# Altium project VisitCard.PrjPcb
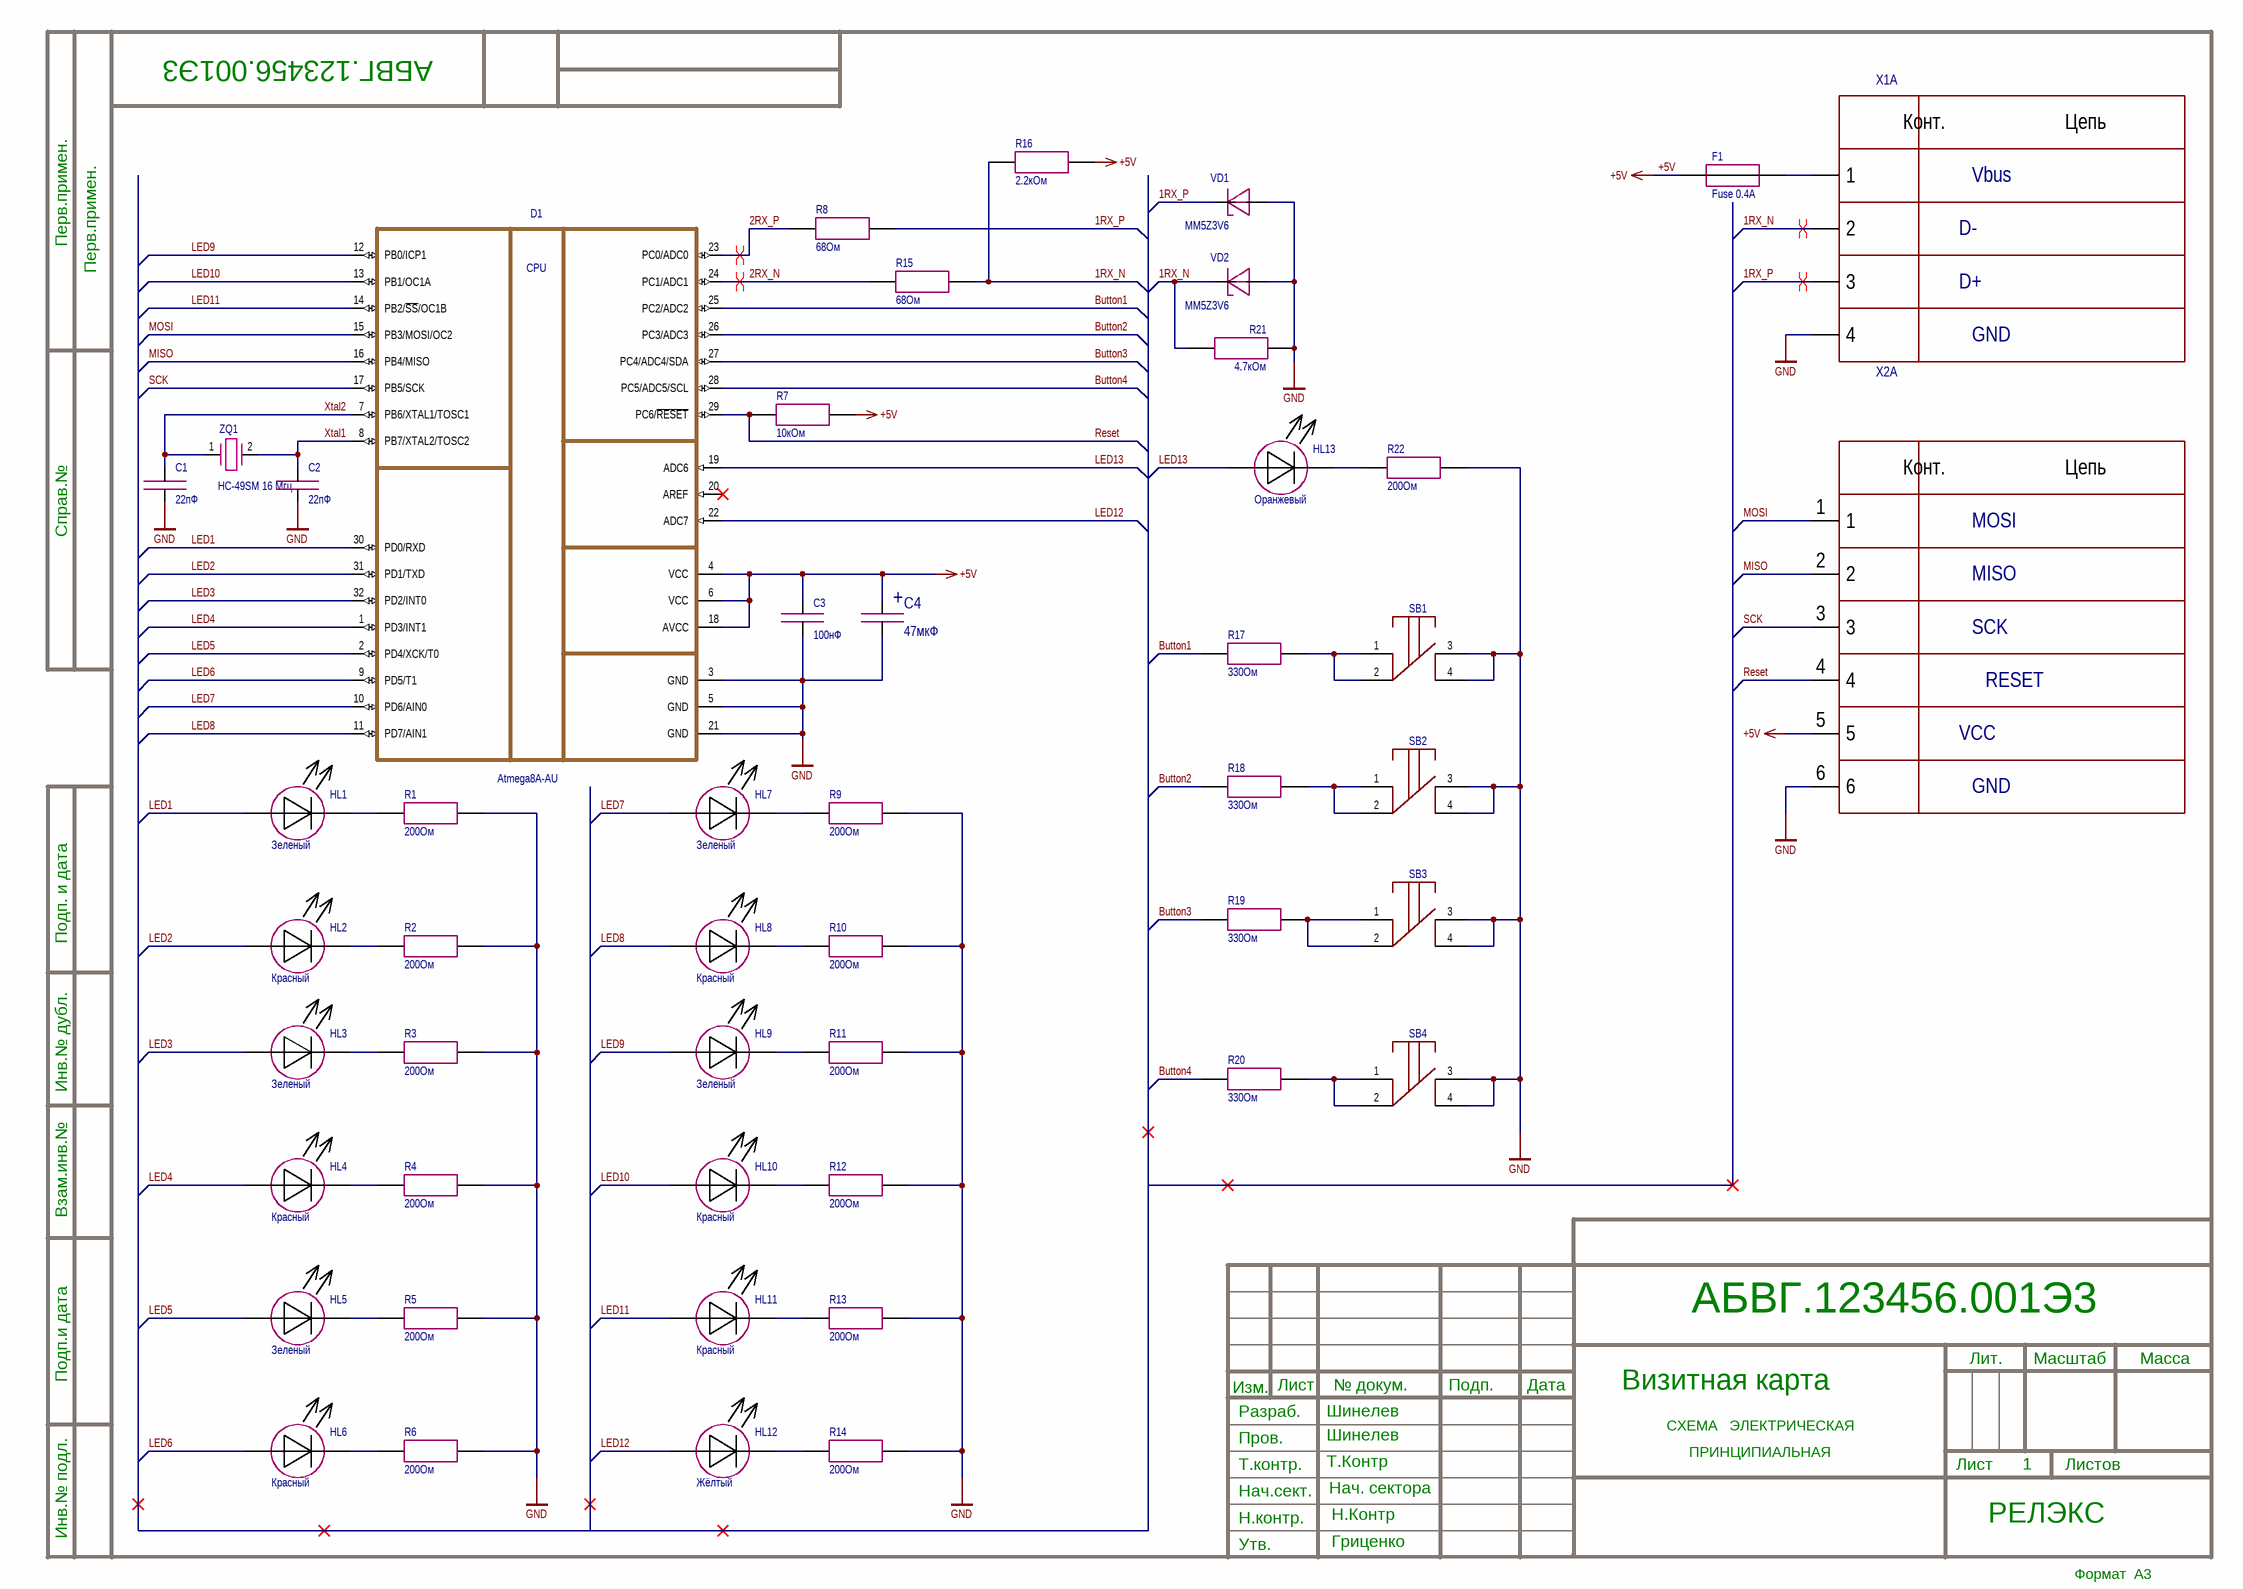
[diagram p0: VisitCardScheme.SchDoc]
1 sheet, 50 parts. Net scope: global (net labels, ports and power ports of the same name join across sheets).
Board file: VisitCardPCB.PcbDoc

## Sheet VisitCardScheme.SchDoc: Наименование
size 420 x 297 mm; Date: 15.06.2018; ApprovedBy: Гриценко; CheckedBy: Шинелев; Author: Шинелев; CompanyName: РЕЛЭКС; DrawnBy: Н.Контр; Engineer: Т.Контр; SheetNumber: 1; SheetTotal: 1; PageSetup: Record=PageOptions|CenterHorizontal=True|CenterVertical=True|PrintScale=0.94|XCorrection=1.00|YCorrection=1.00|PrintKind=1|BorderSize=5000000|LeftOffset=0|BottomOffset=0|Orientation=1|PaperLength=1000|PaperWidth=1000|Scale=100|PaperSource=7|PrintQuality=-4|MediaType=1|DitherType=10|PaperKind=A4|PrintScaleMode=1; DecimalNumber: АБВГ.123456.001Э3; HeadOfSector: Нач. сектора; MainDevice: Перв.примен.; Name: Визитная карта; CurrentDate: 15.06.2018; DocumentName: Sheet1.SCHDOC

### Parts
C1  value 22пФ  [C0603]  (hidden comment: Конденсатор22пФ)
C2  value 22пФ  [C0603]  (hidden comment: Конденсатор22пФ)
C3  value 100нФ  [C0603]  (hidden comment: Конденсатор100нФ)
C4  value 47мкФ  [CaseB]  (hidden comment: Конденсатор 47мкФ)
D1  value Atmega8A-AU  [A32]  (hidden comment: МикросхемаAtmega8A-AU)
F1  Fuse 0.4A  [Fuse 0.4A]
HL1  Примечание: Зеленый  [LED0402_Green]  (hidden comment: СветодиодKPHHS-1005MGCK)
HL2  Примечание: Красный  [LED0402_Red]  (hidden comment: СветодиодKPHHS-1005SURCK)
HL3  Примечание: Зеленый  [LED0402_Green]  (hidden comment: СветодиодKPHHS-1005MGCK)
HL4  Примечание: Красный  [LED0402_Red]  (hidden comment: СветодиодKPHHS-1005SURCK)
HL5  Примечание: Зеленый  [LED0402_Green]  (hidden comment: СветодиодKPHHS-1005MGCK)
HL6  Примечание: Красный  [LED0402_Red]  (hidden comment: СветодиодKPHHS-1005SURCK)
HL7  Примечание: Зеленый  [LED0402_Green]  (hidden comment: СветодиодKPHHS-1005MGCK)
HL8  Примечание: Красный  [LED0402_Red]  (hidden comment: СветодиодKPHHS-1005SURCK)
HL9  Примечание: Зеленый  [LED0402_Green]  (hidden comment: СветодиодKPHHS-1005MGCK)
HL10  Примечание: Красный  [LED0402_Red]  (hidden comment: СветодиодKPHHS-1005SURCK)
HL11  Примечание: Красный  [LED0402_Red]  (hidden comment: СветодиодKPHHS-1005SURCK)
HL12  Примечание: Жёлтый  [LED0402_Yellow]  (hidden comment: СветодиодKPHHS-1005SYCK)
HL13  Примечание: Оранжевый  [LED0402_Orange]  (hidden comment: СветодиодKPHHS-1005SECK)
R1  200Ом  [R0603]
R2  200Ом  [R0603]
R3  200Ом  [R0603]
R4  200Ом  [R0603]
R5  200Ом  [R0603]
R6  200Ом  [R0603]
R7  10кОм  [R0603]
R8  68Ом  [R0603]
R9  200Ом  [R0603]
R10  200Ом  [R0603]
R11  200Ом  [R0603]
R12  200Ом  [R0603]
R13  200Ом  [R0603]
R14  200Ом  [R0603]
R15  68Ом  [R0603]
R16  2.2кОм  [R0603]
R17  330Ом  [R0603]
R18  330Ом  [R0603]
R19  330Ом  [R0603]
R20  330Ом  [R0603]
R21  4.7кОм  [R0603]
R22  200Ом  [R0603]
SB1  Family+Value  [1-1437565-6]  (value not drawn)
SB2  Family+Value  [1-1437565-6]  (value not drawn)
SB3  Family+Value  [1-1437565-6]  (value not drawn)
SB4  Family+Value  [1-1437565-6]  (value not drawn)
VD1  value MM5Z3V6  [SOD-523F]  (hidden comment: СтабилитронMM5Z3V6)
VD2  value MM5Z3V6  [SOD-523F]  (hidden comment: СтабилитронMM5Z3V6)
X1  Вилка USB  [USB]  (value not drawn)  (parts A,B,C,D,E of 5)
X2  (no value)  [SPI]  (parts A,B,C,D,E,F,G of 7)
ZQ1  value HC-49SM 16 Мгц  [HC-49SM]  (hidden comment: РезонаторHC-49SM 16 Мгц)

### Nets
+5V: C3.2 C4.1 D1.4(VCC) D1.6(VCC) D1.18(AVCC) F1.1 R7.2 R16.2 X2.5
GND: C1.1 C2.1 C3.1 C4.2 D1.3(GND) D1.5(GND) D1.21(GND) R1.2 R2.2 R3.2 R4.2 R5.2 R6.2 R9.2 R10.2 R11.2 R12.2 R13.2 R14.2 R21.1 R22.2 SB1.3 SB1.4 SB1.5 SB2.3 SB2.4 SB2.5 SB3.3 SB3.4 SB3.5 SB4.3 SB4.4 SB4.5 VD1.2(A) VD2.2(A) X1.4 X2.6
1RX_N: R15.2 R16.1 R21.2 VD2.1(C) X1.2
1RX_P: R8.2 VD1.1(C) X1.3
2RX_N: D1.24(PC1/ADC1) R15.1
2RX_P: D1.23(PC0/ADC0) R8.1
Button1: D1.25(PC2/ADC2) R17.1
Button2: D1.26(PC3/ADC3) R18.1
Button3: D1.27(PC4/ADC4/SDA) R19.1
Button4: D1.28(PC5/ADC5/SCL) R20.1
LED1: D1.30(PD0/RXD) HL1.1(+)
LED2: D1.31(PD1/TXD) HL2.1(+)
LED3: D1.32(PD2/INT0) HL3.1(+)
LED4: D1.1(PD3/INT1) HL4.1(+)
LED5: D1.2(PD4/XCK/T0) HL5.1(+)
LED6: D1.9(PD5/T1) HL6.1(+)
LED7: D1.10(PD6/AIN0) HL7.1(+)
LED8: D1.11(PD7/AIN1) HL8.1(+)
LED9: D1.12(PB0/ICP1) HL9.1(+)
LED10: D1.13(PB1/OC1A) HL10.1(+)
LED11: D1.14(PB2/~{SS}/OC1B) HL11.1(+)
LED12: D1.22(ADC7) HL12.1(+)
LED13: D1.19(ADC6) HL13.1(+)
MISO: D1.16(PB4/MISO) X2.2
MOSI: D1.15(PB3/MOSI/OC2) X2.1
Reset: D1.29(PC6/~{RESET}) R7.1 X2.4
SCK: D1.17(PB5/SCK) X2.3
Xtal1: C2.2 D1.8(PB7/XTAL2/TOSC2) ZQ1.2
Xtal2: C1.2 D1.7(PB6/XTAL1/TOSC1) ZQ1.1
NetF1_2: F1.2 X1.1
NetHL1_2: HL1.2(-) R1.1
NetHL2_2: HL2.2(-) R2.1
NetHL3_2: HL3.2(-) R3.1
NetHL4_2: HL4.2(-) R4.1
NetHL5_2: HL5.2(-) R5.1
NetHL6_2: HL6.2(-) R6.1
NetHL7_2: HL7.2(-) R9.1
NetHL8_2: HL8.2(-) R10.1
NetHL9_2: HL9.2(-) R11.1
NetHL10_2: HL10.2(-) R12.1
NetHL11_2: HL11.2(-) R13.1
NetHL12_2: HL12.2(-) R14.1
NetHL13_2: HL13.2(-) R22.1
NetR17_2: R17.2 SB1.1 SB1.2
NetR18_2: R18.2 SB2.1 SB2.2
NetR19_2: R19.2 SB3.1 SB3.2
NetR20_2: R20.2 SB4.1 SB4.2

Not connected (* = marked no-connect by the designer): D1 20(AREF)*

### Layout directives
differential pair: 1RX_N, 1RX_P, 2RX_N, 2RX_P

### Notes on the sheet
- Перв.примен.
- Справ.№
- Подп. и дата
- Инв.№ дубл.
- Взам.инв.№
- Подп.и дата
- Разраб.
- Изм.
- Лист
- № докум.
- Подп.
- Дата
- Лит.
- Масштаб
- Масса
- Т.контр.
- Пров.
- СХЕМА   ЭЛЕКТРИЧЕСКАЯ
- ПРИНЦИПИАЛЬНАЯ
- Листов
- Инв.№ подл.
- Утв.
- Н.контр.
- Нач.сект.
- Формат  A3
- (in symbol Atmega8A-AU) CPU
- (in symbol SPI_pcb, part A) Конт.; Цепь
- (in symbol SPI_pcb, part B) MOSI
- (in symbol SPI_pcb, part C) MISO
- (in symbol SPI_pcb, part D) SCK
- (in symbol SPI_pcb, part E) RESET
- (in symbol SPI_pcb, part F) VCC
- (in symbol SPI_pcb, part G) GND
- (in symbol TECAP47/10VB10) +
- (in symbol USB_pcb, part A) Конт.; Цепь
- (in symbol USB_pcb, part B) Vbus
- (in symbol USB_pcb, part C) D-
- (in symbol USB_pcb, part D) D+
- (in symbol USB_pcb, part E) GND

### Library data of the parts
C1 C2 = GRM1885C1H220JA01D: Конденсатор керамический; Manufacturer: Murata; Tolerance: ±5%; Voltage: 50В; ManufacturerPartNumber: GRM1885C1H220JA01D; Part Number: *; Power/Voltage: *; Rem: *; TKE: *; Корпус: C0603; Примечание: *; ComponentLink1Description: Datasheet; ComponentLink1URL: E:\YandexDisk\!Projects\Datasheet\Забугор\Murata\Capacitors ceramic.pdf; ComponentLink2Description: *; ComponentLink2URL: *; Temperature: -55...+125; Family: Конденсатор; Supplier 1: Digi-Key; Supplier Part Number 1: 490-1411-1-ND
C3 = GRM1885C1HR10BD01D: Конденсатор керамический; Manufacturer: Murata; Tolerance: ±5%; Voltage: 50В; ManufacturerPartNumber: GRM1885C1HR10BD01D; Part Number: *; Power/Voltage: *; Rem: *; TKE: *; Корпус: C0603; Примечание: *; ComponentLink1Description: Datasheet; ComponentLink1URL: E:\YandexDisk\!Projects\Datasheet\Забугор\Murata\Capacitors ceramic.pdf; ComponentLink2Description: *; ComponentLink2URL: *; Temperature: -55...+125; Family: Конденсатор; Supplier 1: Mouser; Supplier Part Number 1: 81-GRM1885C1HR10BD1D
C4 = TECAP47/10VB10: Конденсатор танталовый; Manufacturer: TECAP; Temp: -55...+85; TU/GOST: АЖЯР.673546.004ТУ; Tolerance: 10%; Umax: 6.3В; Корпус: CASEB; Family: Конденсатор; ComponentLink1URL: E:\YandexDisk\!Projects\Datasheet\Забугор\Конденсаторы\Танталовые smd.pdf; ComponentLink1Description: Документация; Description2: *; ComponentLink2Description: *; ComponentLink2URL: *; ManufacturerPartNumber: TECAP47/10VB10; Power/Voltage: *; Rem: *; TKE: *; Примечание: *
D1 = Atmega8A-AU: Микроконтроллер, 8 бит, 16 МГц, 8 кБайт FLASH, 1 кБайт SRAM; Manufacturer: Microchip\Atmel; Корпус: 32A; Voltage: 5В; ManufacturerPartNumber: Atmega8A-AU; Part Number: *; Power/Voltage: *; Rem: *; TKE: *; Tolerance: *; Примечание: *; ComponentLink1Description: Datasheet; ComponentLink1URL: E:\YandexDisk\!Projects\Datasheet\Забугор\Atmel\Atmega8a.pdf; ComponentLink2Description: Site; ComponentLink2URL: https://www.microchip.com/wwwproducts/en/ATmega8A; Temperature: -40...+85; Family: Микросхема
F1 = 160016.0,4: Предохранитель 400 мА; Manufacturer: Siba; Power/Voltage: 250В; Current: 400мА; Value: Fuse 0.4A; ManufacturerPartNumber: 160016.0,4; Part Number: *; Rem: *; TKE: *; Tolerance: *; Корпус: *; Примечание: *; ComponentLink1Description: Datasheet; ComponentLink1URL: E:\YandexDisk\!Projects\Datasheet\Забугор\Siba\Fuse.pdf; ComponentLink2Description: *; ComponentLink2URL: *; Family: Предохранитель; Supplier 1: Farnell; Supplier Part Number 1: 2132113
HL1 HL3 HL5 HL7 HL9 = KPHHS-1005MGCK: Светодиод, зеленый, SMD; Manufacturer: Kingbright; Корпус: LED0402; Current: 20мА; Voltage: 2.1В; ManufacturerPartNumber: KPHHS-1005MGCK; Part Number: *; Rem: *; TKE: *; Tolerance: *; ComponentLink1Description: Datasheet; ComponentLink1URL: E:\YandexDisk\!Projects\Datasheet\Забугор\Kingbright\LED smd.pdf; ComponentLink2Description: *; ComponentLink2URL: *; Family: Светодиод; Supplier 1: Farnell; Supplier Part Number 1: 2449865; Value: KPHHS-1005MGCK
HL2 HL4 HL6 HL8 HL10 HL11 = KPHHS-1005SURCK: Светодиод, красный, SMD; Manufacturer: Kingbright; Корпус: LED0402; Current: 20мА; Voltage: 2.1В; ManufacturerPartNumber: KPHHS-1005SURCK; Part Number: *; Rem: *; TKE: *; Tolerance: *; ComponentLink1Description: Datasheet; ComponentLink1URL: E:\YandexDisk\!Projects\Datasheet\Забугор\Kingbright\KPHHS-1005SURCK.pdf; ComponentLink2Description: *; ComponentLink2URL: *; Family: Светодиод; Supplier 1: Farnell; Value: KPHHS-1005SURCK; Supplier Part Number 1: 2449866
HL12 = KPHHS-1005SYCK: Светодиод, жёлтый, SMD; Manufacturer: Kingbright; Корпус: LED0402; Current: 20мА; Voltage: 2.1В; ManufacturerPartNumber: KPHHS-1005SYCK; Part Number: *; Rem: *; TKE: *; Tolerance: *; ComponentLink1Description: Datasheet; ComponentLink1URL: E:\YandexDisk\!Projects\Datasheet\Забугор\Kingbright\KPHHS-1005SURCK.pdf; ComponentLink2Description: *; ComponentLink2URL: *; Family: Светодиод; Value: KPHHS-1005SYCK; Supplier 1: RSComponents; Supplier Part Number 1: 466-3649
HL13 = KPHHS-1005SECK: Светодиод, оранжевый, SMD; Manufacturer: Kingbright; Корпус: LED0402; Current: 20мА; Voltage: 2.1В; ManufacturerPartNumber: KPHHS-1005SECK; Part Number: *; Rem: *; TKE: *; Tolerance: *; ComponentLink1Description: Datasheet; ComponentLink1URL: E:\YandexDisk\!Projects\Datasheet\Забугор\Kingbright\KPHHS-1005SURCK.pdf; ComponentLink2Description: *; ComponentLink2URL: *; Family: Светодиод; Value: KPHHS-1005SECK; Supplier 1: RSComponents; Supplier Part Number 1: 4663627
R1-R6 R9-R14 R22 = CRCW0603200RJNEA: Резистор; Manufacturer: Vishay; Power/Voltage: 0.1Вт; Tolerance: 5%; Voltage: 75В; ManufacturerPartNumber: CRCW0603200RJNEA; Part Number: CRCW0603200RJNEA; Rem: *; TKE: *; Корпус: R0603; Примечание: *; ComponentLink1Description: Datasheet; ComponentLink1URL: E:\YandexDisk\!Projects\Datasheet\Забугор\Vishay\Резисторы CRCW.pdf; ComponentLink2Description: *; ComponentLink2URL: *; Temperature: -55...+155; Family: Резистор; Supplier 1: Digi-Key; Supplier Part Number 1: 541-10KGCT-ND; Value: 200Ом
R7 = CRCW060310K0JNEA: Резистор; Manufacturer: Vishay; Power/Voltage: 0.1Вт; Tolerance: 5%; Voltage: 75В; ManufacturerPartNumber: CRCW060310K0JNEA; Part Number: CRCW060310K0JNEA; Rem: *; TKE: *; Корпус: R0603; Примечание: *; ComponentLink1Description: Datasheet; ComponentLink1URL: E:\YandexDisk\!Projects\Datasheet\Забугор\Vishay\Резисторы CRCW.pdf; ComponentLink2Description: *; ComponentLink2URL: *; Temperature: -55...+155; Family: Резистор; Supplier 1: Digi-Key; Supplier Part Number 1: 541-10KGCT-ND; Value: 10кОм
R8 R15 = CRCW060368R0JNEA: Резистор; Manufacturer: Vishay; Power/Voltage: 0.1Вт; Tolerance: 5%; Voltage: 75В; ManufacturerPartNumber: CRCW060368R0JNEA; Part Number: CRCW060368R0JNEA; Rem: *; TKE: *; Корпус: R0603; Примечание: *; ComponentLink1Description: Datasheet; ComponentLink1URL: E:\YandexDisk\!Projects\Datasheet\Забугор\Vishay\Резисторы CRCW.pdf; ComponentLink2Description: *; ComponentLink2URL: *; Temperature: -55...+155; Family: Резистор; Supplier 1: Digi-Key; Supplier Part Number 1: 541-10KGCT-ND; Value: 68Ом
R16 = CRCW06032K20JNEA: Резистор; Manufacturer: Vishay; ManufacturerPartNumber: CRCW06034K70JNEA; Power/Voltage: 0.1Вт; Tolerance: 5%; Voltage: 75В; Part Number: CRCW06034K70JNEA; Rem: *; TKE: *; Корпус: R0603; Примечание: *; ComponentLink1Description: Datasheet; ComponentLink1URL: E:\YandexDisk\!Projects\Datasheet\Забугор\Vishay\Резисторы CRCW.pdf; ComponentLink2Description: *; ComponentLink2URL: *; Temperature: -55...+155; Family: Резистор; Value: 2.2кОм; Supplier 1: Digi-Key; Supplier Part Number 1: 541-2.2KGTR-ND
R17-R20 = CRCW0603330RJNEA: Резистор; Manufacturer: Vishay; Power/Voltage: 0.1Вт; Tolerance: 5%; Voltage: 75В; ManufacturerPartNumber: CRCW0603330RJNEA; Part Number: CRCW0603330RJNEA; Rem: *; TKE: *; Корпус: R0603; Примечание: *; ComponentLink1Description: Datasheet; ComponentLink1URL: E:\YandexDisk\!Projects\Datasheet\Забугор\Vishay\Резисторы CRCW.pdf; ComponentLink2Description: *; ComponentLink2URL: *; Temperature: -55...+155; Family: Резистор; Value: 330Ом; Supplier 2: Farnell; Supplier Part Number 2: 1692522
R21 = CRCW06034K70JNEA: Резистор; Manufacturer: Vishay; Power/Voltage: 0.1Вт; Tolerance: 5%; Voltage: 75В; ManufacturerPartNumber: CRCW06034K70JNEA; Part Number: CRCW06034K70JNEA; Rem: *; TKE: *; Корпус: R0603; Примечание: *; ComponentLink1Description: Datasheet; ComponentLink1URL: E:\YandexDisk\!Projects\Datasheet\Забугор\Vishay\Резисторы CRCW.pdf; ComponentLink2Description: *; ComponentLink2URL: *; Temperature: -55...+155; Family: Резистор; Value: 4.7кОм
SB1-SB4 = 1-1437565-6: Button; Manufacturer: TE Connectivity; ManufacturerPartNumber: FSM1LP; Part Number: FSM1LP; Power/Voltage: *; Rem: *; TKE: *; Tolerance: *; Корпус: *; Примечание: *; ComponentLink1Description: Datasheet; ComponentLink1URL: E:\YandexDisk\!Projects\Datasheet\Забугор\TE Connectivity\Buttons.pdf; ComponentLink2Description: *; ComponentLink2URL: *; Family: Кнопка; Temperature: -35...+85; Value: 1-1437565-6; Supplier 1: Digi-Key; Supplier Part Number 1: 450-1132-ND
VD1 VD2 = MM5Z3V6: Стабилитрон 3.6В; Manufacturer: ON Semiconductor/Fairchild; ManufacturerPartNumber: MM5Z3V6TR-ND; Power/Voltage: 200мВт; Tolerance: 6%; Part Number: *; Rem: *; TKE: *; Корпус: *; Примечание: *; ComponentLink1Description: Datasheet; ComponentLink1URL: E:\YandexDisk\!Projects\Datasheet\Забугор\Fairchild\Zener MM5.pdf; ComponentLink2Description: *; ComponentLink2URL: *; Temperature: -55...+155; Voltage: *; Family: Стабилитрон; Supplier 1: Digi-Key; Supplier Part Number 1: MM5Z3V6TR-ND
X1 = USB_pcb: Вилка USB 2.0, печать; Примечание: USB вилка на печати; Family: Вилка; Корпус: *; Power/Voltage: *; Value: USB; ComponentLink2Description: *; ComponentLink2URL: *; Rem: *; TKE: *; Tolerance: *
X2 = SPI_pcb: Контакты на печати для программирования по SPI; Power/Voltage: *; ComponentLink2Description: *; ComponentLink2URL: *; Rem: *; TKE: *; Tolerance: *; Примечание: *; Корпус: *
ZQ1 = crystal_16Mhz_hc49sm: Кварцевый резонатор, 16 МГц, 16пФ, 50ppm; Manufacturer: Multicomp; ManufacturerPartNumber: HC49SM-16-30-50-60-16-ATF; Корпус: HC-49/SM; Part Number: *; Power/Voltage: *; Rem: *; TKE: *; Tolerance: *; Примечание: *; ComponentLink1Description: Datasheet; ComponentLink1URL: E:\YandexDisk\!Projects\Datasheet\Забугор\Резонаторы\Multicomp.pdf; ComponentLink2Description: Чип и дип; ComponentLink2URL: https://www.chipdip.ru/product/16mhz-hc-49sm; Temperature: -10...+60; Voltage: *; Family: Резонатор